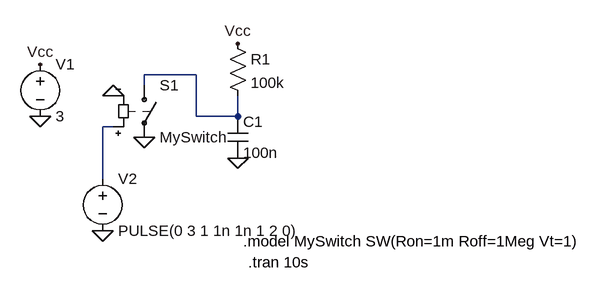
[diagram p0: schematic Draft1.asc]
Draft1.asc, the LTspice schematic file:
Version 4
SHEET 1 880 680
WIRE 224 208 144 208
WIRE 144 224 144 208
WIRE 224 272 224 208
WIRE 288 272 288 240
WIRE 288 272 224 272
WIRE 96 288 80 288
WIRE 80 368 80 288
FLAG 288 336 0
FLAG 288 160 Vcc
FLAG -16 272 0
FLAG -16 192 Vcc
FLAG 144 304 0
FLAG 96 240 0
FLAG 80 448 0
SYMBOL res 272 144 R0
SYMATTR InstName R1
SYMATTR Value 100k
SYMBOL cap 272 272 R0
SYMATTR InstName C1
SYMATTR Value 100n
SYMBOL voltage -16 176 R0
SYMATTR InstName V1
SYMATTR Value 3
SYMBOL sw 144 208 R0
SYMATTR InstName S1
SYMATTR Value MySwitch
SYMBOL voltage 80 352 R0
SYMATTR InstName V2
SYMATTR Value PULSE(0 3 1 1n 1n 1 2 0)
TEXT 296 464 Left 2 !.model MySwitch SW(Ron=1m Roff=1Meg Vt=1)
TEXT 304 496 Left 2 !.tran 10s

The netlist it stands for:
* Draft1.asc
R1 Vcc N001 100k
C1 N001 0 100n
V1 Vcc 0 3
S1 N001 0 N002 0 MySwitch
V2 N002 0 PULSE(0 3 1 1n 1n 1 2 0)
.model MySwitch SW(Ron=1m Roff=1Meg Vt=1)
.tran 10s
.backanno
.end